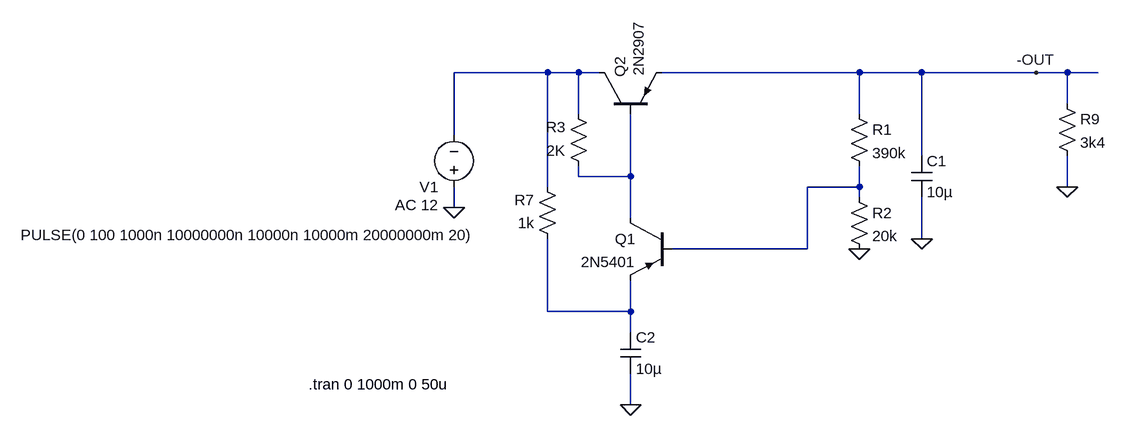
[diagram p0: schematic HV_Reg_Negative 2.asc]
HV_Reg_Negative 2.asc, the LTspice schematic file:
Version 4
SHEET 1 968 680
WIRE -448 -288 -592 -288
WIRE -400 -288 -448 -288
WIRE -368 -288 -400 -288
WIRE 32 -288 -272 -288
WIRE 128 -288 32 -288
WIRE 304 -288 128 -288
WIRE 352 -288 304 -288
WIRE 400 -288 352 -288
WIRE 352 -240 352 -288
WIRE -400 -224 -400 -288
WIRE 32 -224 32 -288
WIRE -592 -192 -592 -288
WIRE 128 -160 128 -288
WIRE -400 -128 -400 -144
WIRE -320 -128 -320 -224
WIRE -320 -128 -400 -128
WIRE -448 -112 -448 -288
WIRE 32 -112 32 -144
WIRE 32 -112 -48 -112
WIRE 352 -112 352 -160
WIRE 32 -96 32 -112
WIRE -592 -80 -592 -112
WIRE -320 -64 -320 -128
WIRE 128 -32 128 -96
WIRE -48 -16 -48 -112
WIRE -48 -16 -256 -16
WIRE -448 80 -448 -32
WIRE -320 80 -320 32
WIRE -320 80 -448 80
WIRE -320 112 -320 80
WIRE -320 224 -320 176
FLAG -320 224 0
FLAG 304 -288 -OUT
FLAG 128 -32 0
FLAG 352 -112 0
FLAG -592 -80 0
FLAG 32 -16 0
DATAFLAG -112 -16 ""
SYMBOL pnp -256 -64 M0
SYMATTR InstName Q1
SYMATTR Value 2N5401
SYMBOL res -432 -16 R180
WINDOW 0 36 76 Left 2
WINDOW 3 36 40 Left 2
SYMATTR InstName R7
SYMATTR Value 1k
SYMBOL cap 112 -160 R0
SYMATTR InstName C1
SYMATTR Value 10µ
SYMBOL res 336 -256 R0
SYMATTR InstName R9
SYMATTR Value 3k4
SYMBOL voltage -592 -96 R180
WINDOW 123 24 -12 Left 2
WINDOW 39 0 0 Left 2
WINDOW 3 -42 -58 Left 2
SYMATTR Value2 AC 12
SYMATTR Value PULSE(0 100 1000n 10000000n 10000n 10000m 20000000m 20)
SYMATTR InstName V1
SYMBOL res 16 -240 R0
SYMATTR InstName R1
SYMATTR Value 390k
SYMBOL res 16 -112 R0
SYMATTR InstName R2
SYMATTR Value 20k
SYMBOL res -384 -128 R180
WINDOW 0 36 76 Left 2
WINDOW 3 36 40 Left 2
SYMATTR InstName R3
SYMATTR Value 2K
SYMBOL pnp -368 -224 R270
WINDOW 3 59 60 Left 2
SYMATTR InstName Q2
SYMATTR Value 2N2907
SYMBOL cap -336 112 R0
SYMATTR InstName C2
SYMATTR Value 10µ
TEXT -816 192 Left 2 !.tran 0 1000m 0 50u

The netlist it stands for:
* HV_Reg_Negative 2.asc
Q1 N002 N003 N004 0 2N5401
R7 N004 N001 1k
C1 -OUT 0 10µ
R9 -OUT 0 3k4
V1 0 N001 PULSE(0 100 1000n 10000000n 10000n 10000m 20000000m 20) AC 12
R1 -OUT N003 390k
R2 N003 0 20k
R3 N002 N001 2K
Q2 N001 N002 -OUT 0 2N2907
C2 N004 0 10µ
.model NPN NPN
.model PNP PNP
.lib standard.bjt
.tran 0 1000m 0 50u
.backanno
.end